# Altium schematic sheet Versorgungsspannung.SchDoc
size A4; CompanyName: Technische Hochschule Nürnberg Georg Simon Ohm; Organization: UltraZohm; Address1: Kesslerplatz 12; Address2: 90489 Nürnberg; Address3: GERMANY; SheetNumber: 4; SheetTotal: 4; Website: www.ultrazohm.com
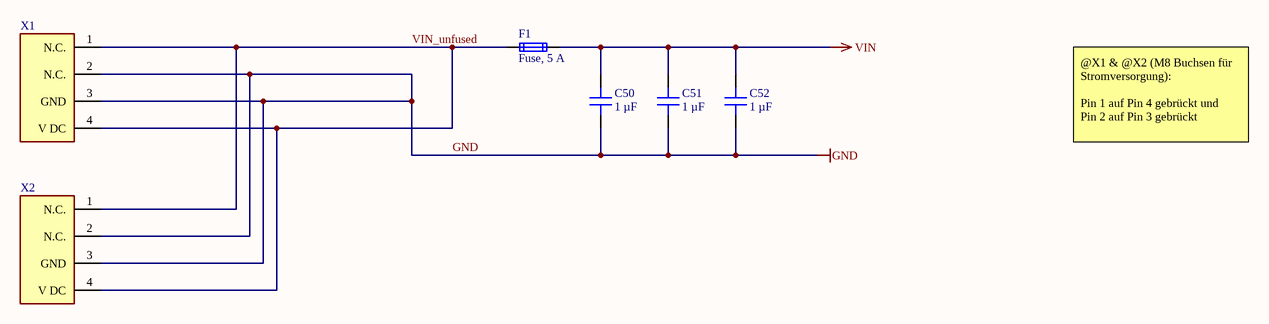
[diagram p0: Versorgungsspannung.SchDoc]

## Parts
C50  1 µF  [C_0603]
C51  1 µF  [C_0603]
C52  1 µF  [C_0603]
F1  Fuse, 5 A  [0154xxx]
X1  CAZN_M12-P4A-GPL_M12  [CAZN_M12-P4A-GPL_M12]  (value not drawn)
X2  CAZN_M12-P4A-GPL_M12  [CAZN_M12-P4A-GPL_M12]  (value not drawn)

## Nets
GND: C50.2 C51.2 C52.2 X1.2(N.C.) X1.3(GND) X2.2(N.C.) X2.3(GND)
VIN: C50.1 C51.1 C52.1 F1.2
VIN_unfused: F1.1 X1.1(N.C.) X1.4(V_DC) X2.1(N.C.) X2.4(V_DC)

## Notes on the sheet
- @X1 & @X2 (M8 Buchsen für Stromversorgung):
  Pin 1 auf Pin 4 gebrückt und
  Pin 2 auf Pin 3 gebrückt
- Title
- Revision:
- Design Engineer:
- Date:
- Project:
- Sheet
- of

## Library data of the parts
C50-C52 = CL10A105KB8NNNC: 50V 1uF X5R ±10% 0603  Multilayer Ceramic Capacitors MLCC - SMD/SMT ROHS; Manufacturer: Samsung Electro-Mechanics; Voltage Rating: 50 VDC; Created from: MGremer; Supplier 1: LCSC; Supplier Part Number 1: C15849; Manufacturer Part Number: CL10A105KB8NNNC; Value: 1 µF; PartID: 5; ComponentLink1Description: Datasheet; ComponentLink1URL: https://datasheet.lcsc.com/lcsc/1810261812_Samsung-Electro-Mechanics-CL10A105KB8NNNC_C15849.pdf; Component Type: Capacitor 0603; Device Package: 0603; Mounting Type: SMD; Operating Temperature: -55 - 85°C; Series: M; Type: Capacitor; Tolerance: 10 %; Live Cycle Status: 1; LCSC Part Number: C15849; Stock number: Labor SMD Container
  C50 C51: Created On: 20.12.2020 13:54:13; Last Updated: 28.11.2022 17:23:01
  C52: Created On: 20/12/2020 13:54:13; Last Updated: 28/11/2022 17:23:01
F1 = 0154005.DR: Fuse OMNI BLOK 154; Manufacturer: Littlefuse; Nominal current: 5 A; Nominal voltage AC: 125 VAC; Nominal voltage DC: 125 VDC; Resistance: 12.5 mOhm; Created from: MGremer; Manufacturer Part Number: 0154005.DR; PartID: 1; Created On: 07/01/2021 10:17:19; ComponentLink1Description: Datasheet; ComponentLink1URL: https://www.mouser.de/datasheet/2/240/Littelfuse_Fuse_154_154T_154L_154TL_Datasheet_pdf-365375.pdf; Component Type: NAN02 - 154 OMNI-BLOK; Device Package: OMNI-BLOK; Last Updated: 12/08/2025 20:50:24; Mounting Type: SMD; Operating Temperature: -55 - 125 °C; Series: 154; Supplier 1: Mouser; Supplier Part Number 1: 576-0154005.DR; Supplier 2: LCSC; Supplier Part Number 2: C206916; Type: Fuse; Value: Fuse, 5 A; Live Cycle Status: 1; LCSC Part Number: C206916
X1 X2 = CAZN_M12-P4A-GPL_M12: M12 Metric Circular Connector, A-Coded, Metal Non-shielded, 4A, 04 pins, Male Connector, Male Contact, Hexagonal, M12*1.0, Screw Thread, PCB 90°; Manufacturer: CAZN; Created from: TGaupp; Manufacturer Part Number: CAZN_M12-P4A-GPL_M12; PartID: 31; Created On: 03/06/2026 11:54:12; ComponentLink1Description: Datasheet; ComponentLink1URL: https://www.lcsc.com/datasheet/C19108992.pdf?spm=wm.sxq.inf.ggs___wm.fly.bg.0.xh&lcsc_vid=TwNaAlRSR1ldAVwCFFVbXlUCQQUIVQcDFgRYX1YFEwcxVlNeR1VZUFBQQ1RbXzsOAxUeFF5JWBYZEEoKFBINSQcJGk4eFQsCAgIaSgADAwAHC0slRVNfUVBSTlZADxALGw%3D%3D; Component Type: M12 A-Type 4 Pole Connector; Device Package: THT; Last Updated: 03/06/2026 13:55:49; Mounting Type: THT; Operating Temperature: -25℃ - 80 ℃; Supplier 1: LCSC; Supplier Part Number 1: C19108992; Type: M12 Connector; Live Cycle Status: 1; LCSC Part Number: C19108992; Stock number: not stored